# Altium schematic sheet Memory.SchDoc: I2C memory
size A4; DrawnBy: Grzegorz Gajoch; Address1: Grzegorz Gajoch; Address2: grzegorz@gajoch.pl; Revision: 1
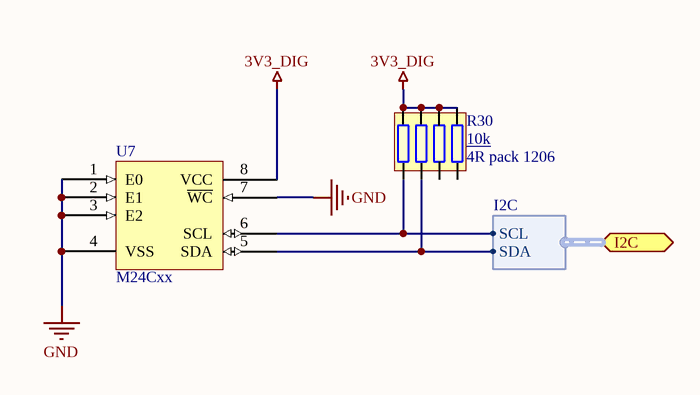
[diagram p0: Memory.SchDoc]

## Parts
R30  10k  [4R pack 1206]
U7  M24Cxx  [SOIC-8_M]

## Ports
I2C (harness I2C)

## Harnesses
I2C: SCL, SDA

## Nets
3V3_DIG: R30.5 R30.6 R30.7 R30.8 U7.8(VCC)
GND: U7.1(E0) U7.2(E1) U7.3(E2) U7.4(VSS) U7.7(~{WC})
NetR30_1: R30.1 U7.6(SCL) ; port I2C.SCL
NetR30_2: R30.2 U7.5(SDA) ; port I2C.SDA

Not connected (* = marked no-connect by the designer): R30 3 4

## Notes on the sheet
- Title
- Size:
- Date:
- A4
- Number:
- Time:
- Revision:
- Sheet
- of
- File:

## Library data of the parts
R30 = Rres_pack_4: 4 resistor pack array; Value: 10k; Package: 4R pack 1206
U7 = M24Cxx: M24Cxx flash memory; ComponentLink1URL: http://www.tme.eu/pl/Document/219e6bd9acfc60fea157d9c160868c29/m24c08-w.pdf; ComponentLink1Description: Datasheet